# EAGLE design simple-loop-v3 (EAGLE 6.6.0)

## Sheet 1 of 2
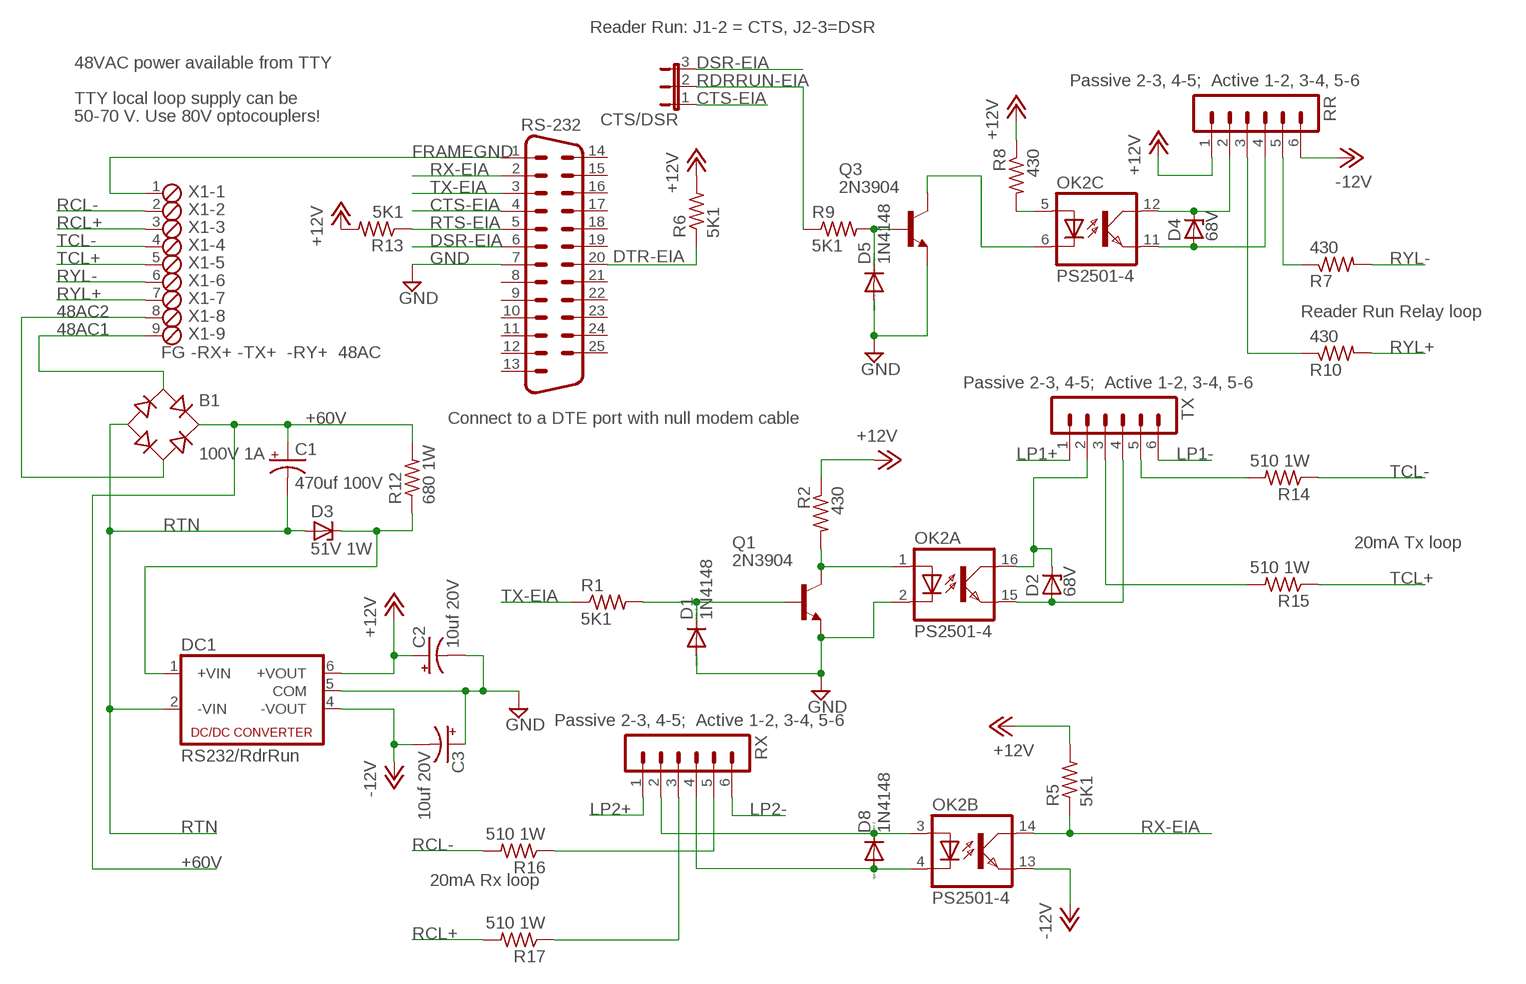
[diagram p0: schematic, sheet 1]

### Parts
B1  100V 1A  RB1A  [RB1A]
C1  470uf 100V  CPOL-USE7.5-18  [E7,5-18]
C2  10uf 20V  CPOL-USE2.5-6  [E2,5-6]
C3  10uf 20V  CPOL-USE2.5-6  [E2,5-6]
CTS/DSR  JP2E  [JP2]
D1  1N4148  1N4148DO35-10  [DO35-10]
D2  68V  ZENER-DIODEDO41Z10  [DO41Z10]
D3  51V 1W  ZENER-DIODEDO41Z10  [DO41Z10]
D4  68V  ZENER-DIODEDO41Z10  [DO41Z10]
D5  1N4148  1N4148DO35-10  [DO35-10]
D8  1N4148  1N4148DO35-10  [DO35-10]
DC1  RS232/RdrRun  NMA  [NMA]
OK2  PS2501-4  PC847  [DIL16]
Q1  2N3904  [TO92]
Q3  2N3904  [TO92]
R1  5K1  R-US_0207/10  [0207/10]
R2  430  R-US_0207/10  [0207/10]
R5  5K1  R-US_0207/10  [0207/10]
R6  5K1  R-US_0207/10  [0207/10]
R7  430  R-US_0207/10  [0207/10]
R8  430  R-US_0207/10  [0207/10]
R9  5K1  R-US_0207/10  [0207/10]
R10  430  R-US_0207/10  [0207/10]
R12  680 1W  R-US_0817/7V  [P0817V]
R13  5K1  R-US_0207/10  [0207/10]
R14  510 1W  R-US_0817/7V  [P0817V]
R15  510 1W  R-US_0817/7V  [P0817V]
R16  510 1W  R-US_0817/7V  [P0817V]
R17  510 1W  R-US_0817/7V  [P0817V]
RR  MA06-1  [MA06-1]
RS-232  M25H  [M25H]
RX  MA06-1  [MA06-1]
TX  MA06-1  [MA06-1]
X1  FG -RX+ -TX+ -RY+ 48AC  MPT9  [9POL254]

### Nets
48AC1 [Supply]: B1.AC1 X1.9
48AC2 [Supply]: B1.AC2 X1.8
+12V: C2.+ DC1.6(+VOUT) R2.1 R5.2 R6.2 R8.1 R13.2 RR.1
+48VDC: D3.C DC1.1(+VIN) R12.1
+60V [Supply]: B1.+ C1.+ R12.2 ; also sheet 2
-12V: C3.- DC1.4(-VOUT) OK2.13(B:EMIT) RR.6
CTS-EIA: CTS/DSR.1 RS-232.4
DSR-EIA: CTS/DSR.3 RS-232.6
DTR-EIA: R6.1 RS-232.20
FRAMEGND: RS-232.1 X1.1
GND [Supply]: C2.- C3.+ D1.A D5.A DC1.5(COM) OK2.2(A:C) Q1.3(E) Q3.3(E) RS-232.7
LP1+: TX.1 ; also sheet 2
LP1-: TX.6 ; also sheet 2
LP2+: RX.1 ; also sheet 2
LP2-: RX.6 ; also sheet 2
N$1: D8.C OK2.3(B:A) RX.2
N$2: R16.1 RX.5
N$3: D8.A OK2.4(B:C) RX.4
N$4: D2.A OK2.15(A:EMIT) TX.4
N$5: OK2.5(C:A) R8.2
N$6: D2.C OK2.16(A:COL) TX.2
N$7: D1.C Q1.2(B) R1.2
N$8: D4.C OK2.12(C:COL) RR.2
N$9: OK2.1(A:A) Q1.1(C) R2.2
N$10: R10.1 RR.3
N$11: R7.1 RR.5
N$15: OK2.6(C:C) Q3.1(C)
N$16: D5.C Q3.2(B) R9.2
N$19: R14.2 TX.5
N$20: R17.1 RX.3
N$21: R15.2 TX.3
N$22: D4.A OK2.11(C:EMIT) RR.4
RCL+: R17.2 X1.3
RCL-: R16.2 X1.2
RDRRUN-EIA: CTS/DSR.2 R9.1
RTN [Supply]: B1.- C1.- D3.A DC1.2(-VIN) ; also sheet 2
RTS-EIA: R13.1 RS-232.5
RX-EIA: OK2.14(B:COL) R5.1 RS-232.2
RYL+: R10.2 X1.7
RYL-: R7.2 X1.6
TCL+: R15.1 X1.5
TCL-: R14.1 X1.4
TX-EIA: R1.1 RS-232.3
Unconnected: RS-232.8 RS-232.9 RS-232.10 RS-232.11 RS-232.12 RS-232.13 RS-232.14 RS-232.15 RS-232.16 RS-232.17 RS-232.18 RS-232.19 RS-232.21 RS-232.22 RS-232.23 RS-232.24 RS-232.25

### Notes on the sheet
- Reader Run: J1-2 = CTS, J2-3=DSR
- 48VAC power available from TTY
- Passive 2-3, 4-5;  Active 1-2, 3-4, 5-6
- TTY local loop supply can be
- 50-70 V. Use 80V optocouplers!
- Reader Run Relay loop
- Passive 2-3, 4-5;  Active 1-2, 3-4, 5-6
- Connect to a DTE port with null modem cable
- 20mA Tx loop
- Passive 2-3, 4-5;  Active 1-2, 3-4, 5-6
- 20mA Rx loop

## Sheet 2 of 2
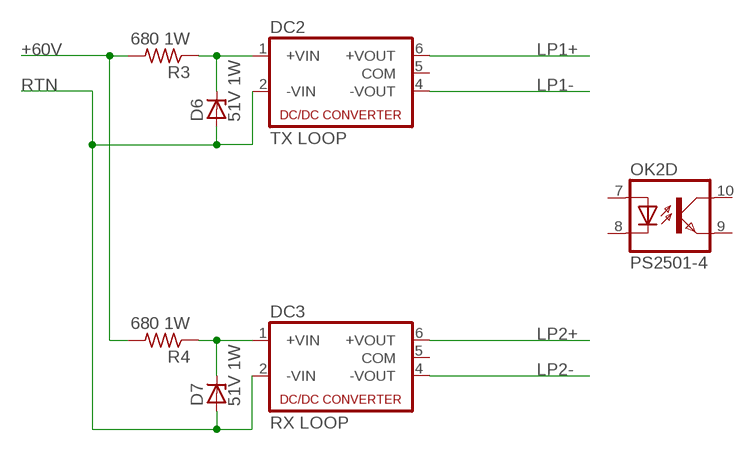
[diagram p1: schematic, sheet 2]

### Parts
D6  51V 1W  ZENER-DIODEDO41Z10  [DO41Z10]
D7  51V 1W  ZENER-DIODEDO41Z10  [DO41Z10]
DC2  TX LOOP  NMA  [NMA]
DC3  RX LOOP  NMA  [NMA]
R3  680 1W  R-US_0817/7V  [P0817V]
R4  680 1W  R-US_0817/7V  [P0817V]

### Nets
+48VDC1: D6.C DC2.1(+VIN) R3.1
+48VDC2: D7.C DC3.1(+VIN) R4.1
+60V [Supply]: R3.2 R4.2 ; also sheet 1
LP1+: DC2.6(+VOUT) ; also sheet 1
LP1-: DC2.4(-VOUT) ; also sheet 1
LP2+: DC3.6(+VOUT) ; also sheet 1
LP2-: DC3.4(-VOUT) ; also sheet 1
RTN [Supply]: D6.A D7.A DC2.2(-VIN) DC3.2(-VIN) ; also sheet 1
Unconnected: DC2.5(COM) DC3.5(COM) OK2.7(D:A) OK2.8(D:C) OK2.9(D:EMIT) OK2.10(D:COL)

## Library data of the parts
B1 = rectifier:RB1A: RECTIFIER 1 A
C1-C3 = rcl:CPOL-US: POLARIZED CAPACITOR, American symbol
CTS/DSR = jumper:JP2E: JUMPER
D1 D5 D8 = diode:1N4148: DIODE high speed (Philips)
D2-D4 D6 D7 = diode:ZENER-DIODE: Z-Diode
DC1-DC3 = dc-dc-converter:NMA: DC-DC CONVERTER; MF: C & D TECHNOLOGIES, INC; MPN: NMA0515SC; OC_FARNELL: 1021434; OC_NEWARK: 61K3064
OK2 = optocoupler:PC847: SHARP OPTO COUPLER; OC_FARNELL: 9707735; OC_NEWARK: unknown
Q1 Q3 = transistor-npn:2N3904: NPN Transistor
R1-R10 R12-R17 = rcl:R-US_: RESISTOR, American symbol
RR RX TX = con-lstb:MA06-1: PIN HEADER; OC_FARNELL: unknown; OC_NEWARK: unknown
RS-232 = con-subd:M25: SUB-D; OC_FARNELL: unknown; OC_NEWARK: unknown
X1 = con-phoenix-254:MPT9: PHOENIX CONNECTOR; OC_FARNELL: unknown; OC_NEWARK: unknown

## Net classes
1 Supply: width 0.508 mm, clearance 0.381 mm

## Board
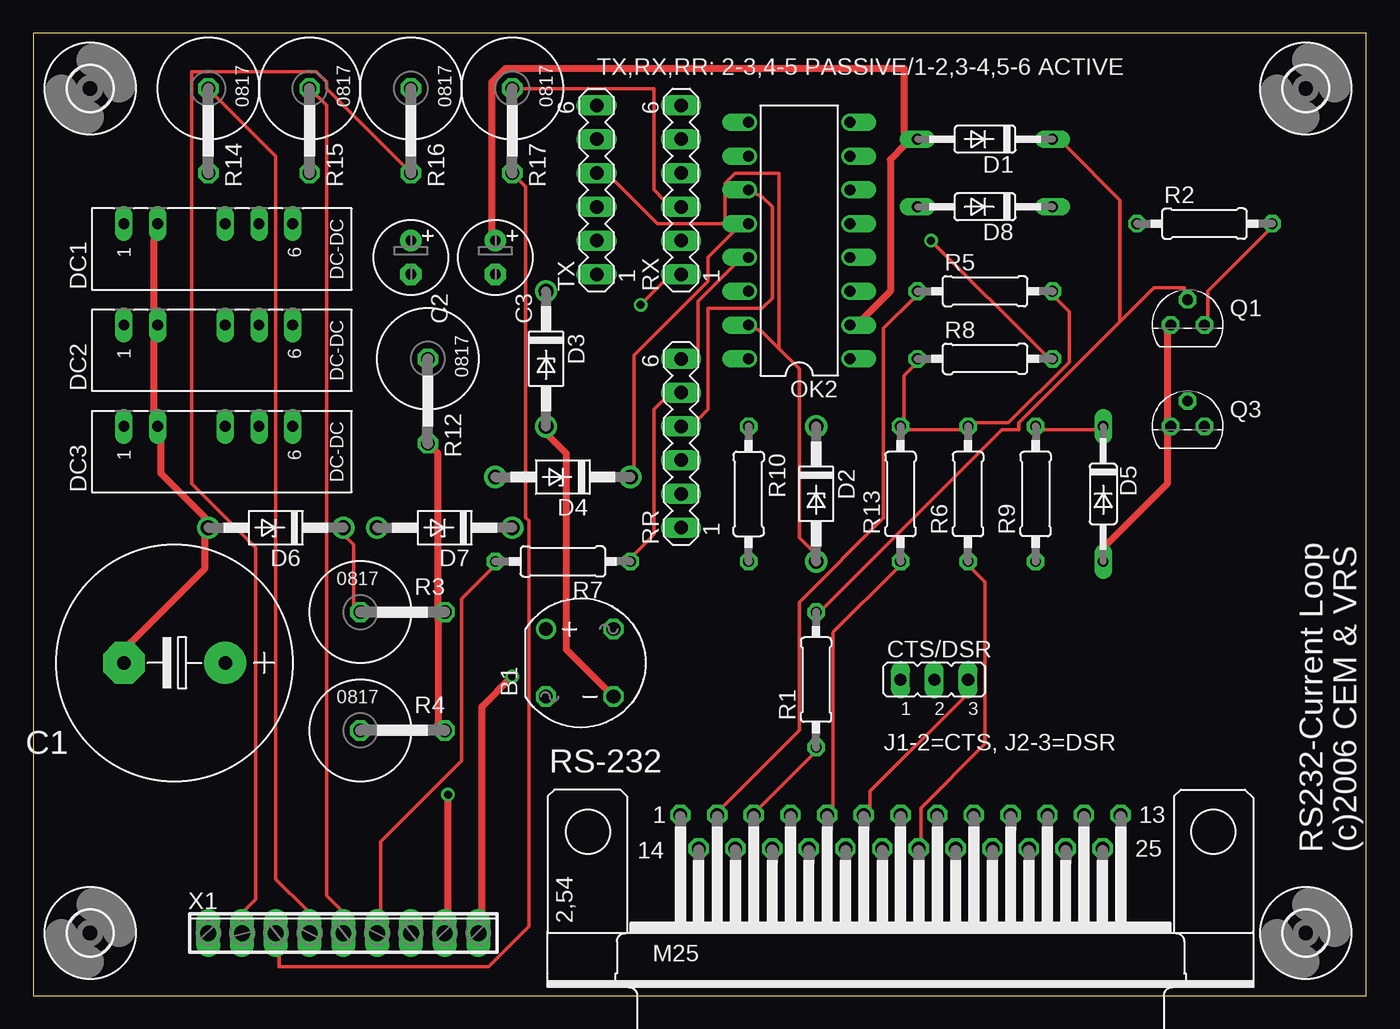
[diagram p2: board, top side]
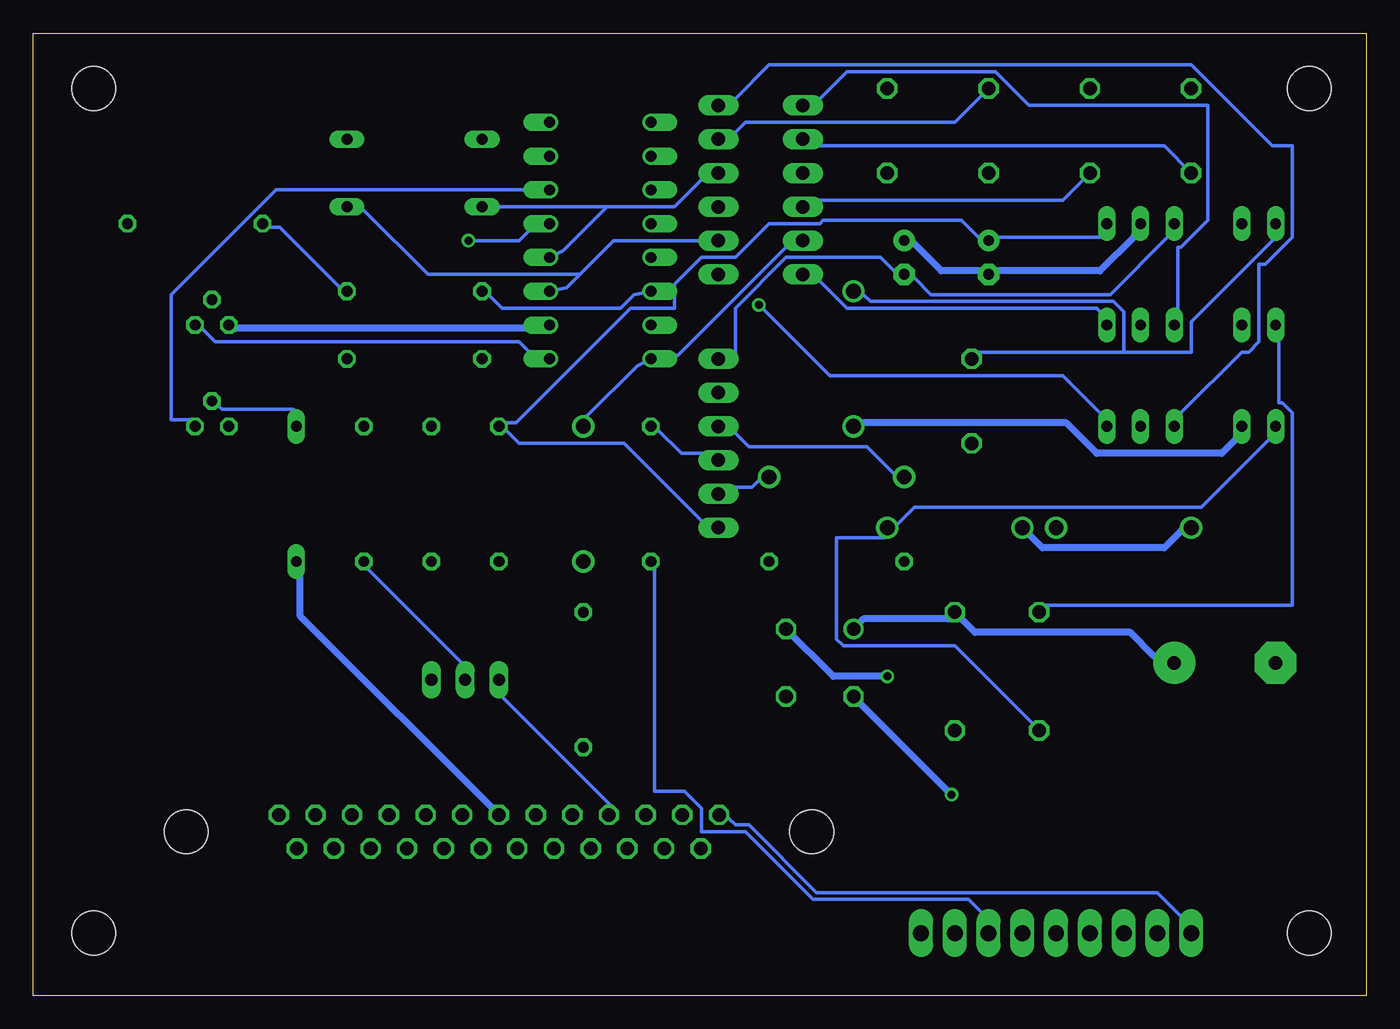
[diagram p3: board, bottom side, seen from below]

Size 100.27 x 72.37 mm. Coordinates in mm from the lower left corner, seen from the top.
Outline: 100.27,0 100.27,72.37 0,72.37 0,0 100.27,0
Copper layers (1*16): Top 0.035mm / dielectric 1.5mm / Bottom 0.035mm
Design rules "10mils *": minimum track width 10mil, minimum drill 24mil, track to track 10mil, track to pad 10mil, pad to pad 10mil, via to via 10mil, smd to smd 10mil, copper to edge 40mil, drill to drill 10mil, minimum pad ring 10mil, minimum via ring 8mil, stop-mask expansion 0mil, vias tented up to drill 0mil, thermal gap 10mil

### Footprints (pad centres in the part's own frame; a part is rotated, then mirrored left to right if it is on the bottom)
RB1A = drill 1.016: + -2.54,2.54 | drill 1.016 octagon: - 2.54,-2.54; AC1 2.54,2.54; AC2 -2.54,-2.54
E7,5-18 = drill 1.016 pad 3.15: + -3.81,0 | drill 1.016 pad 3.15 octagon: - 3.81,0
E2,5-6 = drill 0.813 pad 1.6: + -1.27,0 | drill 0.813 pad 1.6 octagon: - 1.27,0
JP2 = drill 0.914 long: 1 -2.54,0; 2 0,0; 3 2.54,0
DO35-10 = drill 0.813 long: A 5.08,0; C -5.08,0
DO41Z10 = drill 1.118: A 5.08,0; C -5.08,0
NMA = drill 0.813 long: 1 0,6.35; 2 0,3.81; 4 0,-1.27; 5 0,-3.81; 6 0,-6.35
DIL16 = drill 0.813 offset: 1 -8.89,-3.81; 2 -6.35,-3.81; 3 -3.81,-3.81; 4 -1.27,-3.81; 5 1.27,-3.81; 6 3.81,-3.81; 7 6.35,-3.81; 8 8.89,-3.81; 9 8.89,3.81; 10 6.35,3.81; 11 3.81,3.81; 12 1.27,3.81; 13 -1.27,3.81; 14 -3.81,3.81; 15 -6.35,3.81; 16 -8.89,3.81
TO92 = drill 0.813 octagon: 1 1.27,0; 2 0,1.905; 3 -1.27,0
0207/10 = drill 0.813 octagon: 1 -5.08,0; 2 5.08,0
P0817V = drill 1.016 octagon: 1 -5.08,0; 2 1.27,0
MA06-1 = drill 1.016 long: 1 -6.35,0; 2 -3.81,0; 3 -1.27,0; 4 1.27,0; 5 3.81,0; 6 6.35,0
M25H = drill 1.016 octagon: 1 -16.561,1.27; 2 -13.792,1.27; 3 -11.049,1.27; 4 -8.28,1.27; 5 -5.512,1.27; 6 -2.769,1.27; 7 0,1.27; 8 2.769,1.27; 9 5.512,1.27; 10 8.28,1.27; 11 11.049,1.27; 12 13.792,1.27; 13 16.561,1.27; 14 -15.189,-1.27; 15 -12.421,-1.27; 16 -9.652,-1.27; 17 -6.909,-1.27; 18 -4.14,-1.27; 19 -1.372,-1.27; 20 1.372,-1.27; 21 4.14,-1.27; 22 6.909,-1.27; 23 9.652,-1.27; 24 12.421,-1.27; 25 15.189,-1.27 | hole 3.302: 23.52,0; -23.52,0
3,3 = hole 3.3: 0,0
9POL254 = drill 1.2 long: 1 -10.16,0; 2 -7.62,0; 3 -5.08,0; 4 -2.54,0; 5 0,0; 6 2.54,0; 7 5.08,0; 8 7.62,0; 9 10.16,0

### Placement (x,y rotation side)
B1  41.11,25.03 0 top
C1  10.63,25.03 180 top
C2  28.41,55.51 270 top
C3  34.76,55.51 270 top
CTS/DSR  67.78,23.76 0 top
D1  71.59,64.4 180 top
D2  58.89,37.73 270 top
D3  38.57,47.89 270 top
D4  39.84,39 180 top
D5  80.48,37.73 270 top
D6  18.25,35.19 180 top
D7  30.95,35.19 180 top
D8  71.59,59.32 180 top
DC1  13.17,58.05 90 top
DC2  13.17,50.43 90 top
DC3  13.17,42.81 90 top
OK2  57.62,56.78 90 top
Q1  86.83,50.43 0 top
Q3  86.83,42.81 0 top
R1  58.89,23.76 90 top
R2  88.1,58.05 0 top
R3  29.68,28.84 0 top
R4  29.68,19.95 0 top
R5  71.59,52.97 0 top
R6  70.32,37.73 90 top
R7  39.84,32.65 180 top
R8  71.59,47.89 0 top
R9  75.4,37.73 90 top
R10  53.81,37.73 270 top
R12  29.68,42.81 270 top
R13  65.24,37.73 90 top
R14  13.17,63.13 270 top
R15  20.79,63.13 270 top
R16  28.41,63.13 270 top
R17  36.03,63.13 270 top
RR  48.73,41.54 90 top
RS-232  65.24,12.33 0 top
RX  48.73,60.59 90 top
TX  42.38,60.59 90 top
U$1  [3,3]  4.28,68.21 0 top
U$2  [3,3]  4.28,4.71 0 top
U$3  [3,3]  95.72,68.21 0 top
U$4  [3,3]  95.72,4.71 0 top
X1  23.33,4.71 0 top

### Tracks (layer width: path | path; a pad name or v marks a point on that pad's centre or on a via)
48AC1  (via drill 0.61)
  Top 0.508: v36.03,24.01 33.74,21.73 33.74,6.49 X1.9
  Bottom 0.508: v36.03,24.01 40.09,24.01 B1.AC1
48AC2  (via drill 0.61)
  Top 0.508: v31.2,15.12 31.2,6.49 X1.8
  Bottom 0.508: v31.2,15.12 B1.AC2
+12V
  Top 0.254: R8.1 66.26,47.38 65.49,46.62 65.49,43.32 R13.2 65.75,42.56 69.81,42.56 R6.2 70.83,43.06 73.37,43.06 77.94,47.64 77.94,51.45 76.92,52.46 R5.2
  Bottom 0.254: R5.2 77.18,53.22 81.75,57.8 82.51,57.8 R2.1 | DC1.6 20.03,57.03 27.65,57.03 C2.+ 29.17,57.03 30.44,58.3 40.86,58.3 41.11,58.05 44.92,58.05 47.46,55.51 50,55.51 52.03,53.48 52.03,51.7 55.33,51.7 63.97,43.06 64.73,43.06 R13.2 64.73,42.56 63.72,41.54 55.84,41.54 50,35.7 RR.1
+48VDC
  Bottom 0.254: 18.25,48.4 29.17,48.4 R12.1 | 18.25,48.4 13.17,48.4 13.17,50.68 7.07,56.78 DC1.1 | 18.25,48.4 18.25,51.45 19.01,52.21 37.3,52.21 37.81,52.72 D3.C
+48VDC1
  Top 0.254: D6.C 23.58,34.43 24.09,33.92 24.09,29.35 R3.1
  Bottom 0.254: DC2.1 6.57,49.16 6.57,44.59 6.31,44.59 5.55,43.83 5.55,29.35 24.09,29.35 R3.1
+48VDC2
  Bottom 0.254: DC3.1 7.33,41.79 12.41,36.71 34,36.71 35.27,35.44 D7.C 36.28,34.43 39.84,34.43 39.84,26.81 39.33,26.3 30.95,26.3 R4.1
+60V
  Top 0.508: R4.2 30.44,20.46 30.44,28.33 R3.2 30.44,29.35 30.44,40.78 R12.2
  Bottom 0.508: B1.+ 37.81,28.33 31.46,28.33 R3.2 29.43,27.32 17.74,27.32 15.96,25.54 C1.+
-12V
  Top 0.254: OK2.13 52.79,55 50,52.21 50,48.4 RR.6
  Bottom 0.254: DC1.4 14.95,57.03 19.27,52.72 32.73,52.72 34,53.99 C3.- 35.52,54.49 36.54,55.51 43.65,55.51 47.46,51.7 47.46,48.4 RR.6
CTS-EIA
  Bottom 0.254: CTS/DSR.1 64.99,22.49 56.6,14.11 RS-232.4
DSR-EIA
  Top 0.254: CTS/DSR.3 70.07,22.49 62.95,15.38 62.95,14.11 RS-232.6
DTR-EIA
  Top 0.254: R6.1 70.57,32.14 71.59,31.13 71.59,18.93 66.76,14.11 66.76,11.57 RS-232.20
FRAMEGND
  Bottom 0.254: RS-232.1 47.97,13.35 47.46,12.84 46.44,12.84 41.36,7.76 15.71,7.76 13.93,5.98 X1.1
GND
  Top 0.508: OK2.2 62.45,50.94 64.48,52.97 64.48,62.88 65.49,63.89 D1.A 65.49,64.91 65.49,69.73 35.52,69.73 34.51,68.72 34.51,57.54 C3.+ | D5.A 80.73,33.92 85.31,38.49 85.31,42.3 Q3.3 85.31,43.32 85.31,49.92 Q1.3
  Bottom 0.508: DC1.5 17.49,57.03 20.03,54.49 27.65,54.49 C2.- 29.17,54.49 31.97,54.49 34,56.53 C3.+ | RS-232.7 80.23,28.59 80.23,31.38 D5.A | OK2.2 62.7,50.18 85.05,50.18 Q1.3
LP1+
  Bottom 0.254: DC2.6 20.03,51.45 20.28,51.7 39.08,51.7 41.11,53.73 TX.1
LP1-
  Bottom 0.254: DC2.4 14.19,51.7 14.19,56.27 13.93,56.27 11.9,58.3 11.9,66.94 25.36,66.94 27.9,69.48 39.08,69.48 41.11,67.45 TX.6
LP2+  (via drill 0.61)
  Top 0.254: v45.68,51.95 47.46,53.73 RX.1
  Bottom 0.254: v45.68,51.95 40.35,46.62 22.82,46.62 20.03,43.83 DC3.6
LP2-
  Bottom 0.254: DC3.4 13.93,43.83 9.36,48.4 8.85,48.4 8.09,49.16 8.09,55 7.58,55 5.55,57.03 5.55,63.89 7.07,63.89 13.17,69.99 44.92,69.99 47.46,67.45 RX.6
N$1
  Bottom 0.254: 59.14,54.24 56.6,56.78 RX.2 | 59.14,54.24 60.16,53.22 OK2.3 | 59.14,54.24 70.57,54.24 75.4,59.07 D8.C
N$2
  Bottom 0.254: R16.1 30.95,65.67 46.7,65.67 47.46,64.91 RX.5
N$3
  Bottom 0.254: 57.11,59.32 52.03,59.32 50,61.35 RX.4 | 57.11,59.32 D8.A | 57.11,59.32 60.41,56.02 OK2.4
N$4
  Top 0.254: 56.1,48.65 57.62,47.13 57.62,34.43 58.64,33.41 D2.A | 56.1,48.65 54.83,49.92 OK2.15 | 56.1,48.65 56.1,61.86 52.79,61.86 52.03,61.1 52.03,58.05 46.95,58.05 43.65,61.35 TX.4
N$5  (via drill 0.61)
  Top 0.254: v67.53,56.78 76.16,48.14 R8.2
  Bottom 0.254: v67.53,56.78 63.72,56.78 62.7,57.8 OK2.5
N$6
  Bottom 0.254: D2.C 58.64,43.57 54.83,47.38 OK2.16 52.54,48.14 51.78,48.14 43.65,56.27 TX.2
N$7
  Top 0.254: 81.75,50.68 84.29,53.22 86.58,53.22 86.58,52.97 Q1.2 | 81.75,50.68 74.13,43.06 74.13,42.56 72.86,42.56 59.4,29.09 R1.2 | 81.75,50.68 81.75,59.83 77.69,63.89 D1.C
N$8
  Top 0.254: OK2.12 52.79,57.54 50.76,55.51 50.76,53.73 45.17,48.14 45.17,39.76 D4.C
  Bottom 0.254: D4.C 45.68,38.75 46.19,38.24 47.46,38.24 RR.2
N$9
  Top 0.254: R2.2 92.93,57.54 88.35,52.97 88.35,50.94 Q1.1
  Bottom 0.254: OK2.1 62.7,48.14 63.72,49.16 86.58,49.16 87.59,50.18 Q1.1
N$10
  Bottom 0.254: R10.1 53.3,42.56 51.52,40.78 50,40.78 RR.3
N$11
  Top 0.254: R7.1 45.17,33.16 46.7,34.68 46.7,44.08 47.46,44.84 RR.5
N$15
  Bottom 0.254: OK2.6 82,60.59 89.88,52.72 89.88,43.32 88.35,43.32 Q3.1
N$16
  Top 0.254: R9.2 75.91,42.56 79.97,42.56 D5.C
  Bottom 0.254: Q3.2 86.32,44.33 86.07,44.08 80.73,44.08 D5.C
N$19
  Bottom 0.254: R14.2 15.2,63.89 41.11,63.89 TX.5
N$20
  Top 0.254: R17.1 46.7,68.21 46.7,60.59 47.46,59.83 RX.3
N$21
  Bottom 0.254: R15.2 22.82,59.83 41.11,59.83 TX.3
N$22
  Top 0.254: OK2.11 54.83,60.08 55.59,59.32 55.59,52.46 54.83,51.7 50.76,51.7 50.76,44.08 50,43.32 RR.4
  Bottom 0.254: D4.A 35.52,39.25 37.55,41.29 46.44,41.29 47.46,42.3 RR.4
RCL+
  Top 0.254: R17.2 37.05,60.84 37.05,35.95 37.3,35.7 37.3,5.22 34.25,2.17 18.5,2.17 18.5,2.93 X1.3
RCL-
  Top 0.254: R16.2 22.06,68.21 22.06,68.72 21.3,69.48 11.9,69.48 11.9,38.49 16.73,33.67 16.73,7.25 15.96,6.49 X1.2
RDRRUN-EIA
  Bottom 0.254: R9.1 75.15,32.14 68.03,25.03 CTS/DSR.2
RTN
  Top 0.508: B1.- 40.09,26.05 40.09,40.78 38.82,42.05 D3.A | DC1.2 9.11,56.78 9.11,51.7 DC2.2 9.11,49.16 9.11,44.08 DC3.2 9.61,41.54 9.61,39.25 12.92,35.95 D6.A 12.92,34.43 12.92,32.14 7.33,26.55 C1.-
  Bottom 0.508: D7.A 24.35,33.67 15.2,33.67 13.93,34.94 D6.A | D3.A 37.81,43.06 22.57,43.06 20.28,40.78 10.88,40.78 9.87,41.79 DC3.2
RTS-EIA
  Top 0.254: R13.1 64.99,32.14 60.16,27.32 60.16,14.11 RS-232.5
RX-EIA
  Top 0.254: R5.1 66.26,52.46 63.97,50.18 63.97,35.95 57.62,29.6 57.62,19.95 51.78,14.11 RS-232.2
  Bottom 0.254: OK2.14 55.08,52.72 56.1,51.7 64.99,51.7 66,52.72 R5.1
RYL+
  Bottom 0.254: R10.2 53.56,32.14 53.56,15.38 51.27,15.38 50,14.11 50,12.33 46.7,12.33 41.62,7.25 29.93,7.25 28.92,6.23 X1.7
RYL-
  Top 0.254: R7.2 34.51,32.14 32.22,29.86 32.22,17.66 26.12,11.57 26.12,6.49 X1.6
TCL+
  Top 0.254: R15.1 22.06,66.94 22.06,7.5 23.08,6.49 X1.5
TCL-
  Top 0.254: R14.1 18.25,63.13 18.25,8.77 20.54,6.49 X1.4
TX-EIA
  Top 0.254: R1.1 58.64,18.17 54.57,14.11 RS-232.3

### Text on the board
tNames: TX,RX,RR: 2-3,4-5 PASSIVE/1-2,3-4,5-6 ACTIVE | J1-2=CTS, J2-3=DSR | RS232-Current Loop | (c)2006 CEM & VRS